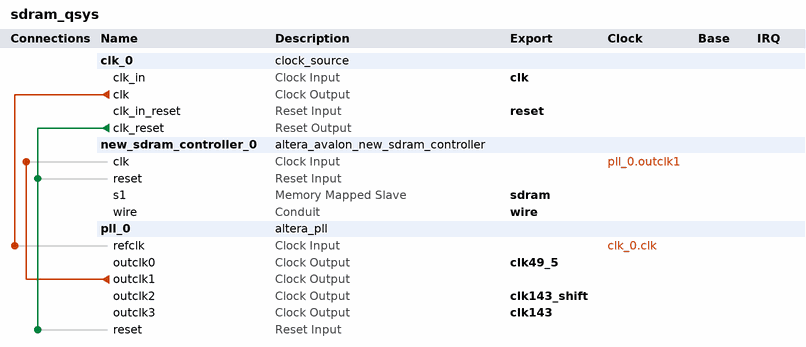
[diagram p0: system contents]
# Platform Designer (Qsys) system sdram_qsys, Cyclone V 5CSEMA5F31C6
# Parameters at their usual value, and those the tool derives, are not listed.
package require -exact qsys 17.0
create_system sdram_qsys
set_project_property DEVICE_FAMILY {Cyclone V}
set_project_property DEVICE 5CSEMA5F31C6

add_instance clk_0 clock_source 17.0
set_instance_parameter_value clk_0 clockFrequency 50000000

add_instance new_sdram_controller_0 altera_avalon_new_sdram_controller 17.0
set_instance_parameter_value new_sdram_controller_0 TAC 5.5
set_instance_parameter_value new_sdram_controller_0 TRCD 15.0
set_instance_parameter_value new_sdram_controller_0 TRP 15.0
set_instance_parameter_value new_sdram_controller_0 casLatency 3
set_instance_parameter_value new_sdram_controller_0 columnWidth 10
set_instance_parameter_value new_sdram_controller_0 dataWidth 16
set_instance_parameter_value new_sdram_controller_0 generateSimulationModel false
set_instance_parameter_value new_sdram_controller_0 model single_Micron_MT48LC4M32B2_7_chip
set_instance_parameter_value new_sdram_controller_0 numberOfBanks 4
set_instance_parameter_value new_sdram_controller_0 numberOfChipSelects 1
set_instance_parameter_value new_sdram_controller_0 powerUpDelay 100.0
set_instance_parameter_value new_sdram_controller_0 refreshPeriod 7.8
set_instance_parameter_value new_sdram_controller_0 rowWidth 13

add_instance pll_0 altera_pll 17.0
set_instance_parameter_value pll_0 gui_device_speed_grade 1
set_instance_parameter_value pll_0 gui_number_of_clocks 4
set_instance_parameter_value pll_0 gui_operation_mode direct
set_instance_parameter_value pll_0 gui_output_clock_frequency0 49.5
set_instance_parameter_value pll_0 gui_output_clock_frequency1 143.0
set_instance_parameter_value pll_0 gui_output_clock_frequency2 143.0
set_instance_parameter_value pll_0 gui_output_clock_frequency3 143.0
set_instance_parameter_value pll_0 gui_phase_shift2 -52
set_instance_parameter_value pll_0 gui_pll_mode {Integer-N PLL}
set_instance_parameter_value pll_0 gui_ps_units2 degrees
set_instance_parameter_value pll_0 gui_reference_clock_frequency 50.0
set_instance_parameter_value pll_0 gui_use_locked false

# connections
add_connection clk_0.clk pll_0.refclk clock
add_connection pll_0.outclk1 new_sdram_controller_0.clk clock
add_connection clk_0.clk_reset new_sdram_controller_0.reset reset
add_connection clk_0.clk_reset pll_0.reset reset

# exported interfaces
add_interface clk clock sink
set_interface_property clk EXPORT_OF clk_0.clk_in
add_interface clk143 clock source
set_interface_property clk143 EXPORT_OF pll_0.outclk3
add_interface clk143_shift clock source
set_interface_property clk143_shift EXPORT_OF pll_0.outclk2
add_interface clk49_5 clock source
set_interface_property clk49_5 EXPORT_OF pll_0.outclk0
add_interface reset reset sink
set_interface_property reset EXPORT_OF clk_0.clk_in_reset
add_interface sdram avalon slave
set_interface_property sdram EXPORT_OF new_sdram_controller_0.s1
add_interface wire conduit end
set_interface_property wire EXPORT_OF new_sdram_controller_0.wire

set_interconnect_requirement {$system} qsys_mm.clockCrossingAdapter HANDSHAKE
set_interconnect_requirement {$system} qsys_mm.enableEccProtection FALSE
set_interconnect_requirement {$system} qsys_mm.insertDefaultSlave FALSE
set_interconnect_requirement {$system} qsys_mm.maxAdditionalLatency 1

save_system sdram_qsys.qsys
